# Altium schematic sheet MACHNGUON.SchDoc
size A; SheetNumber: 2; SheetTotal: 2
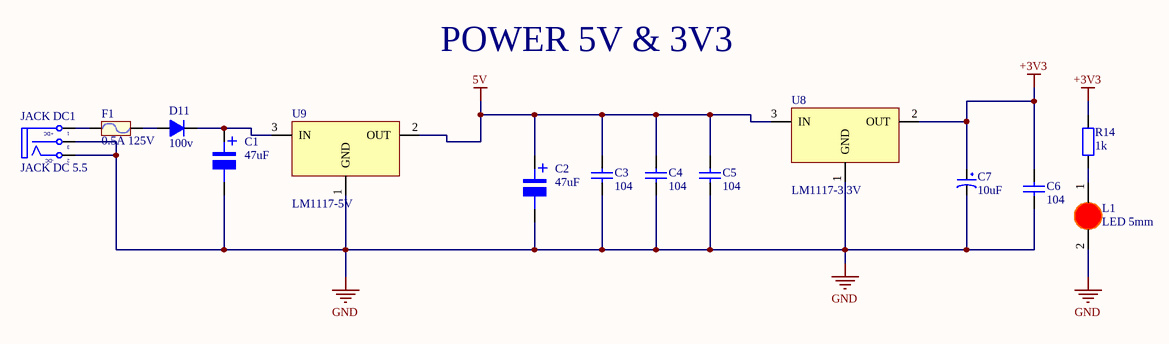
[diagram p0: MACHNGUON.SchDoc]

## Parts
C1  47uF  [tu nhom 6.3 (D)]
C2  47uF  [tu nhom 6.3 (D)]
C3  104  [tu gom]
C4  104  [tu gom]
C5  104  [tu gom]
C6  104  [tu gom]
C7  10uF  [tu hoa 13mm]
D11  100v  [DIODE 1A]
F1  0.5A 125V  [Cau Chi SMD1808]
JACK_DC1  JACK DC 5.5  [JACK DC 5.5]
L1  LED 5mm  [LED-5MM-RED]
R14  1k  [tro vach 1/2w]
U8  LM1117-3.3V  [TO220-123]
U9  LM1117-5V  [TO220-123]

## Nets
5V: C2.1 C3.1 C4.1 C5.1 U8.3(IN) U9.2(OUT)
+3V3: C6.1 C7.1 R14.2 U8.2(OUT)
GND: C1.2 C2.2 C3.2 C4.2 C5.2 C6.2 C7.2 JACK_DC1.2(TN) JACK_DC1.3(S) L1.2(K) U8.1(GND) U9.1(GND)
NetC1_1: C1.1 D11.2(K) U9.3(IN)
NetD11_1: D11.1(A) F1.2
NetF1_1: F1.1 JACK_DC1.1(T)
NetL1_1: L1.1(A) R14.1

## Notes on the sheet
- POWER 5V & 3V3
- (in symbol JACK DC 5.5) +DC; -DC
- (in symbol Tu Nhom 47uF 16V) +

## Library data of the parts
C1 C2 = Tu Nhom 47uF 16V: Dán; Don_Vi: Con; So_Chan: 2; Ten_Linh_Kien: Tụ Nhôm 47uF 16V; Ma_Hang: MH007468; Chung_Loai: Dán; Kieu_Chan: *
C3-C6 = Tu gom 104 50V: Cắm; So_Chan: 2; Ten_Linh_Kien: Tụ gốm 104 100nF 50V; Don_Vi: Con; Ma_Hang: MH004761; Chung_Loai: Cắm; Kieu_Chan: *
C7 = Tu Hoa 10uF 450V 13x20: Cắm; Don_Vi: Con; So_Chan: 2; Ten_Linh_Kien: Tụ Hóa 10uF 450V 13x20MM; Ma_Hang: MH003950; Chung_Loai: Cắm; Kieu_Chan: *
D11 = Diode 1N4007: Cắm; Ten_Linh_Kien: Diode 1N4007 1A (DIP); Don_Vi: Con; Ma_Hang: MH001063; Ghi Chu: *; Kieu_Chan: *; Chung_Loai: Cắm
F1 = Cau chi 0.5A 125V SMD1808: Ma_Hang: MH009241; Ten: Cầu Chì 0.5A 125V SMD1808 0451.500MRL
JACK_DC1 = JACK DC 5.5: Value: Jac DC
L1 = LED 5mm Do: Cắm; Don_Vi: Con; Ma_Hang: MH008967; Ten_Linh_Kien: Led 5MM Phủ Đỏ (1000c); Ghi_Chu: *; Kieu_Chan: *; Chung_Loai: Cắm
R14 = Tro Vach 1/2W 5% 1k: Cắm; Don_Vi: Con; So_Chan: 2; Ten_Linh_Kien: Trở 5% 1/2w 1K; Ma_Hang: MH007240; Chung_Loai: Cắm; Kieu_Chan: *
U8 U9 = LM1117: 800mA Low-Dropout Linear Regulator; Creator: Nguyen Ba Bien; Website: http://group3i.net